# Altium schematic sheet 2312_ESP32.SchDoc
size A3; Author: Miguel Santos; Organization: ETML-ES; Address1: Avenue Recordon 1; Address2: 1004 Lausanne; Address3: Switzerland; SheetNumber: 5; SheetTotal: 7; Version: 1.0
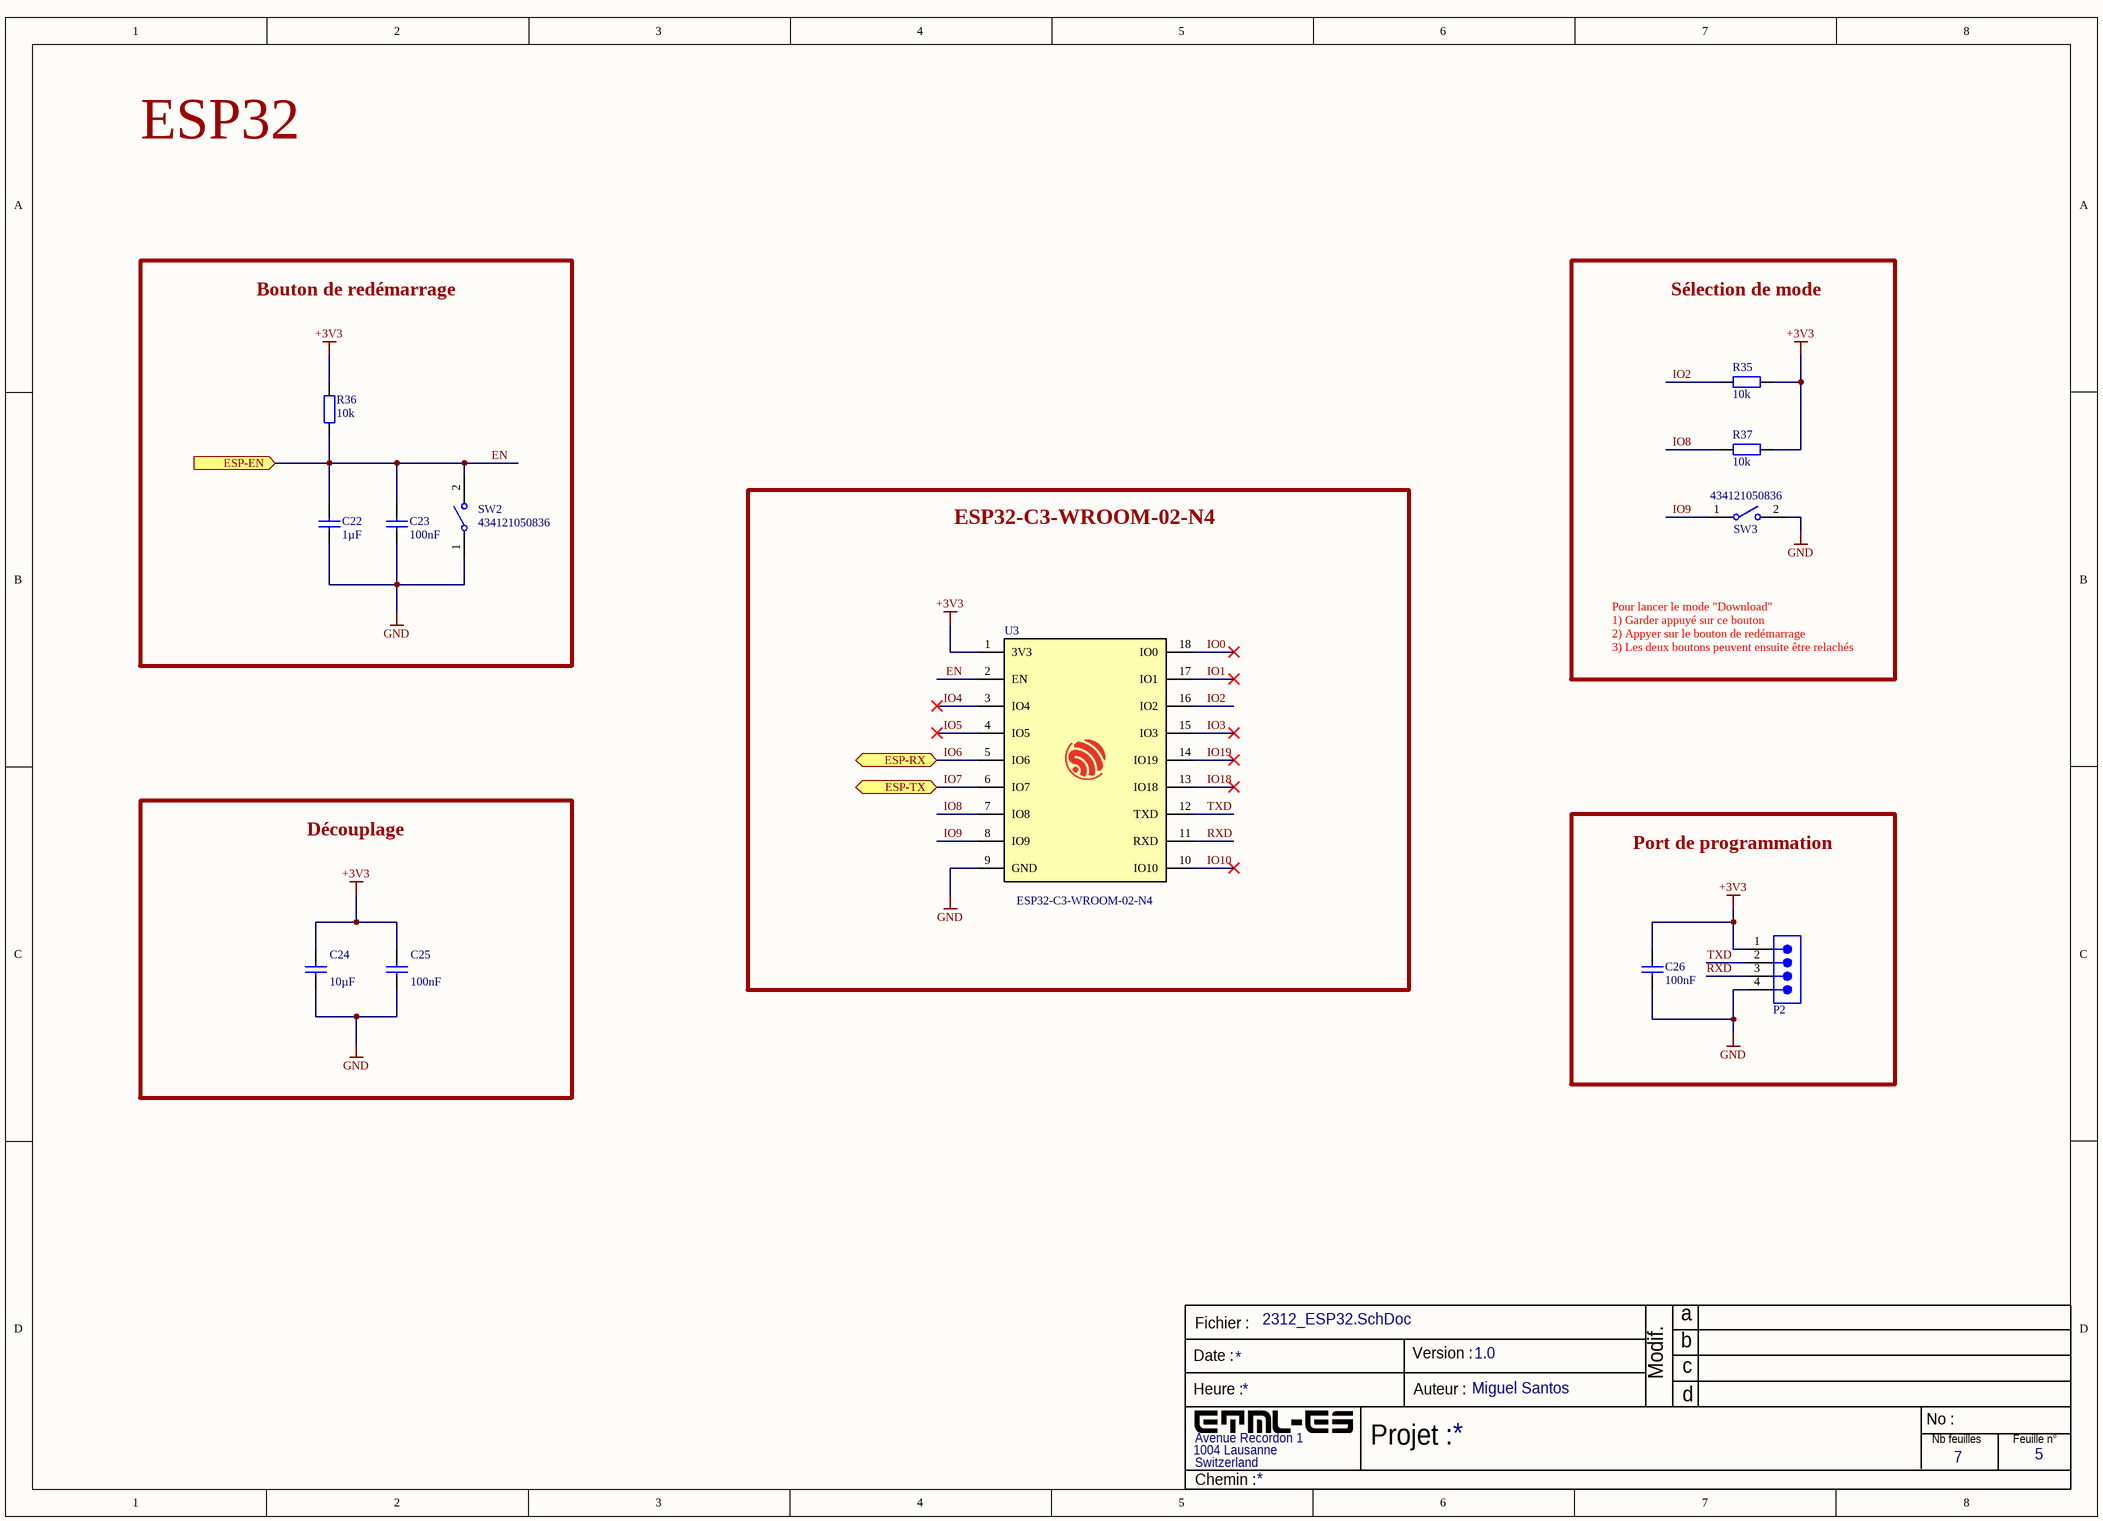
[diagram p0: 2312_ESP32.SchDoc]

## Parts
C22  Capacitance: 1µF  [WCAP-CSGP_0805_L2W1.25H1.25]  (hidden comment: 885012207022)
C23  Capacitance: 100nF  [WCAP-CSGP_0805_L2W1.25H0.8_Reflow]  (hidden comment: 885012207016)
C24  Capacitance: 10µF  [WCAP-CSGP_0805_L2W1.25H1.25]  (hidden comment: 885012107004)
C25  Capacitance: 100nF  [WCAP-CSGP_0805_L2W1.25H0.8_Reflow]  (hidden comment: 885012207016)
C26  Capacitance: 100nF  [WCAP-CSGP_0805_L2W1.25H0.8_Reflow]  (hidden comment: 885012207016)
P2  61300411121  [61300411121]  (value not drawn)
R35  Resistance: 10k  [2312-RES-0805]  (hidden comment: RES-0805)
R36  Resistance: 10k  [2312-RES-0805]  (hidden comment: RES-0805)
R37  Resistance: 10k  [2312-RES-0805]  (hidden comment: RES-0805)
SW2  434121050836  [WS-TASV_L6W3.5H5_4341x10508x6]
SW3  434121050836  [WS-TASV_L6W3.5H5_4341x10508x6]
U3  ESP32-C3-WROOM-02-N4  [ESP32C3WROOM02N4]

## Blocks framed on the sheet
Bouton de redémarrage: C22 C23 R36 SW2
Sélection de mode: R35 R37 SW3
ESP32-C3-WROOM-02-N4: U3
Découplage: C24 C25
Port de programmation: C26 P2

## Ports
ESP-EN (in), ESP-RX (bidir), ESP-TX (bidir)

## Nets
+3V3: C24.2 C25.2 C26.2 P2.1 R35.1 R36.1 R37.2 U3.1(3V3)
GND: C22.1 C23.2 C24.1 C25.1 C26.1 P2.4 SW2.1 SW3.2 U3.9(GND)
EN: C22.2 C23.1 R36.2 SW2.2 U3.2(EN) ; port ESP-EN
IO0: U3.18(IO0)
IO1: U3.17(IO1)
IO2: R35.2 U3.16(IO2)
IO3: U3.15(IO3)
IO4: U3.3(IO4)
IO5: U3.4(IO5)
IO6: U3.5(IO6) ; port ESP-RX
IO7: U3.6(IO7) ; port ESP-TX
IO8: R37.1 U3.7(IO8)
IO9: SW3.1 U3.8(IO9)
IO10: U3.10(IO10)
IO18: U3.13(IO18)
IO19: U3.14(IO19)
RXD: P2.3 U3.11(RXD)
TXD: P2.2 U3.12(TXD)

## Notes on the sheet
- ESP32
- Pour lancer le mode "Download"
  1) Garder appuyé sur ce bouton
  2) Appyer sur le bouton de redémarrage
  3) Les deux boutons peuvent ensuite être relachés
- Fichier :
- a
- Date :
- Heure :
- Version :
- Auteur :
- Modif.
- b
- c
- d
- Projet :
- No :
- Nb feuilles
- Feuille n°
- Chemin :

## Library data of the parts
C22 = 885012207022: WCAP-CSGP Multilayer Ceramic Chip Capacitor, General Purpose, size 0805, X7R, 1µF, 10VDC; Manufacturer: Wurth Elektronik; Case/Size Code: 0805; Capacitance Tolerance: +/-10%; Dissipation Factor: 5%; Insulation Resistance: 0.5GΩ; Rated Voltage (DC): 10V; Technical Reference: X7R0805105K010DFCT10000; Manufacturer Part Number: 885012207022; Category: Multilayer Ceramic Chip Capacitors; Match Code: WCAP-CSGP; ComponentLink1Description: Website Link; ComponentLink1URL: https://www.we-online.com/redexpert/article/885012207022?ad; ComponentLink2Description: Datasheet Link; ComponentLink2URL: https://www.we-online.com/redexpert/spec/885012207022?ad; Mount: Surface Mount; Operating Temperature Max: 125°C; Operating Temperature Min: -55°C; Packaging: Tape and Reel; Length: 2mm; Width: 1.25mm; Height: 1.25mm; Ceramic Type: X7R
C23 C25 C26 = 885012207016: WCAP-CSGP Multilayer Ceramic Chip Capacitor, General Purpose, size 0805, X7R, 100nF, 10VDC; Manufacturer: Wurth Elektronik; Case/Size Code: 0805; Capacitance Tolerance: +/-10%; Dissipation Factor: 5%; Insulation Resistance: 5GΩ; Rated Voltage (DC): 10V; Technical Reference: X7R0805104K010DFCT10000; Manufacturer Part Number: 885012207016; Category: Multilayer Ceramic Chip Capacitors; Match Code: WCAP-CSGP; ComponentLink1Description: Website Link; ComponentLink1URL: https://www.we-online.com/redexpert/article/885012207016?ad; ComponentLink2Description: Datasheet Link; ComponentLink2URL: https://www.we-online.com/redexpert/spec/885012207016?ad; Mount: Surface Mount; Operating Temperature Max: 125°C; Operating Temperature Min: -55°C; Packaging: Tape and Reel; Length: 2mm; Width: 1.25mm; Height: 0.8mm; Ceramic Type: X7R
C24 = 885012107004: WCAP-CSGP Multilayer Ceramic Chip Capacitor, General Purpose, size 0805, X5R, 10µF, 6.3VDC; Manufacturer: Wurth Elektronik; Case/Size Code: 0805; Capacitance Tolerance: +/-20%; Dissipation Factor: 15%; Insulation Resistance: 0.01GΩ; Rated Voltage (DC): 6.3V; Technical Reference: X5R0805106M6R3DFCT10000; Manufacturer Part Number: 885012107004; Category: Multilayer Ceramic Chip Capacitors; Match Code: WCAP-CSGP; ComponentLink1Description: Website Link; ComponentLink1URL: https://www.we-online.com/redexpert/article/885012107004?ad; ComponentLink2Description: Datasheet Link; ComponentLink2URL: https://www.we-online.com/redexpert/spec/885012107004?ad; Mount: Surface Mount; Operating Temperature Max: 85°C; Operating Temperature Min: -55°C; Packaging: Tape and Reel; Length: 2mm; Width: 1.25mm; Height: 1.25mm; Ceramic Type: X5R
P2 = 61300411121: WR-PHD Pin Header, THT, Vertical, pitch 2.54mm, 1 Row, 4P; Manufacturer: Wurth Elektronik; Contact Resistance: 20mΩ; Rated Current: 3A; Working Voltage: 250V; Withstanding Voltage: 500V; ComponentLink1Description: Website Link; ComponentLink1URL: https://www.we-online.com/redexpert/article/61300411121?ad; ComponentLink2Description: Datasheet Link; ComponentLink2URL: https://www.we-online.com/redexpert/spec/61300411121?ad; Manufacturer Part Number: 61300411121; Category: Board-to-Board Connectors; Match Code: WR-PHD; Mount: Through Hole; Operating Temperature Max: 105°C; Operating Temperature Min: -40°C; Packaging: Bag; Gender: Pin Header; Number of Pins: 4; Number of Rows: 1; Orientation: Vertical; Pitch: 2.54mm
R35-R37 = RES-0805: SMD Resistor 0805, 10kΩ
SW2 SW3 = 434121050836: WS-TASV SMT Tact Switch, L6 x W3.5 x H5mm, 360g, SPST-NO, 12V, 50mA; Manufacturer: Wurth Elektronik; Washable: No; Manufacturer Part Number: 434121050836; Category: Tact Switches; Match Code: WS-TASV; ComponentLink1Description: Website Link; ComponentLink1URL: https://www.we-online.com/redexpert/article/434121050836?ad; ComponentLink2Description: Datasheet Link; ComponentLink2URL: https://www.we-online.com/redexpert/spec/434121050836?ad; Mount: Surface Mount; Operating Temperature Max: 85°C; Operating Temperature Min: -40°C; Packaging: Tape and Reel; Length: 6mm; Width: 3.5mm; Height: 5mm; Circuit: SPST-NO; Contact Material: Stainless Steel; Contact Plating: Silver; Operation Force: 360g; Rated Current: 50mA; Rated Voltage (DC): 12V; Terminal Material: Copper Alloy; Terminal Plating: Silver
U3 = ESP32-C3-WROOM-02-N4: WiFi Modules (802.11) (Engineering Samples) SMD module, ESP32-C3, 4MB SPI flash, PCB antenna, -40 C +85 C; Manufacturer_Name: Espressif Systems; Geometry.Height: 3.35mm; Manufacturer_Part_Number: ESP32-C3-WROOM-02-N4; Mouser Part Number: 356-ESP32C3WROOM02N4; Mouser Price/Stock: https://www.mouser.co.uk/ProductDetail/Espressif-Systems/ESP32-C3-WROOM-02-N4?qs=stqOd1AaK7%2FqjTZKEOgfUg%3D%3D; Arrow Part Number: *; Arrow Price/Stock: *; Datasheet Link: https://www.mouser.ch/datasheet/2/891/Espressif_ESP32_C3_WROOM_02-2006871.pdf